# EAGLE design shield (EAGLE 6.5.0)
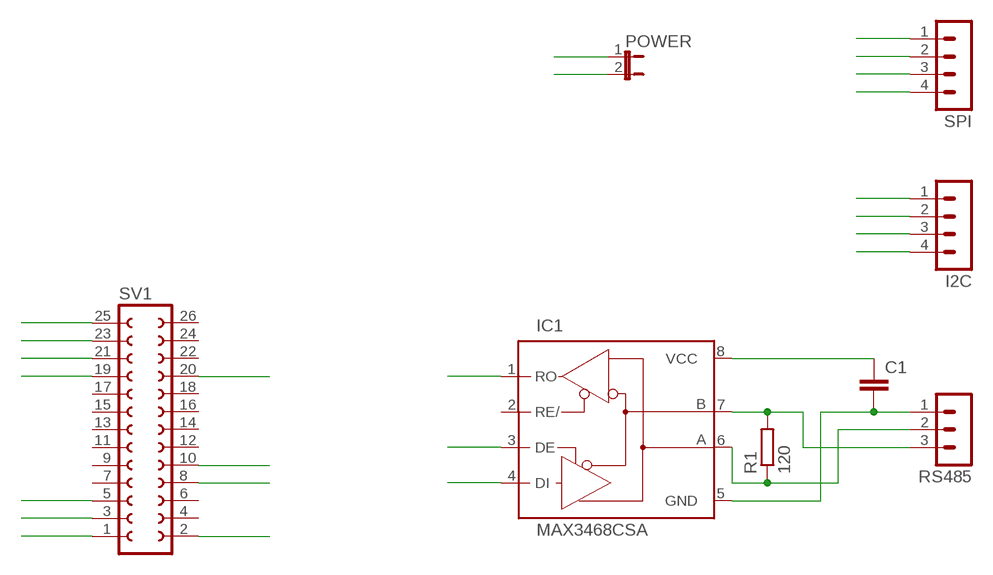
[diagram p0: schematic, sheet 1]

## Parts
C1  C-EUC0805  [C0805]
I2C  MA04-1  [MA04-1]
IC1  MAX3468CSA  [SO08]
POWER  JP1E  [JP1]
R1  120  R-EU_0207/2V  [0207/2V]
RS485  MA03-1  [MA03-1]
SPI  MA04-1  [MA04-1]
SV1  FE13-2  [FE13-2]

## Nets
3V3: C1.1 IC1.3(DE) IC1.8(VCC) SV1.1
5V0: I2C.4 POWER.2 SV1.2
GND: C1.2 I2C.1 IC1.5(GND) POWER.1 RS485.1 SPI.1 SV1.20 SV1.25
MISO: SPI.3 SV1.21
MOSI: SPI.2 SV1.19
N$1: IC1.6(A) R1.1 RS485.2
N$3: IC1.7(B) R1.2 RS485.3
RX: IC1.1(RO) SV1.10
SCL: I2C.2 SV1.5
SCLK: SPI.4 SV1.23
SDA: I2C.3 SV1.3
TX: IC1.4(DI) SV1.8
Unconnected: IC1.2(RE/) SV1.4 SV1.6 SV1.7 SV1.9 SV1.11 SV1.12 SV1.13 SV1.14 SV1.15 SV1.16 SV1.17 SV1.18 SV1.22 SV1.24 SV1.26

## Library data of the parts
C1 = rcl:C-EU: CAPACITOR, European symbol
I2C SPI = con-lstb:MA04-1: PIN HEADER; OC_FARNELL: unknown; OC_NEWARK: unknown
IC1 = maxim:MAX34*: +5V, Fail-Safe, 40Mbps, Profibus RS-485/RS-422 Transceivers Source: MAX3465-MAX3469.pdf; MPN: MAX3468CSA+; OC_FARNELL: unknown; OC_NEWARK: 76K6721
POWER = jumper:JP1E: JUMPER
R1 = rcl:R-EU_: RESISTOR, European symbol
RS485 = con-lstb:MA03-1: PIN HEADER; OC_FARNELL: unknown; OC_NEWARK: unknown
SV1 = con-lsta:FE13-2: FEMALE HEADER; OC_FARNELL: unknown; OC_NEWARK: unknown

## Board
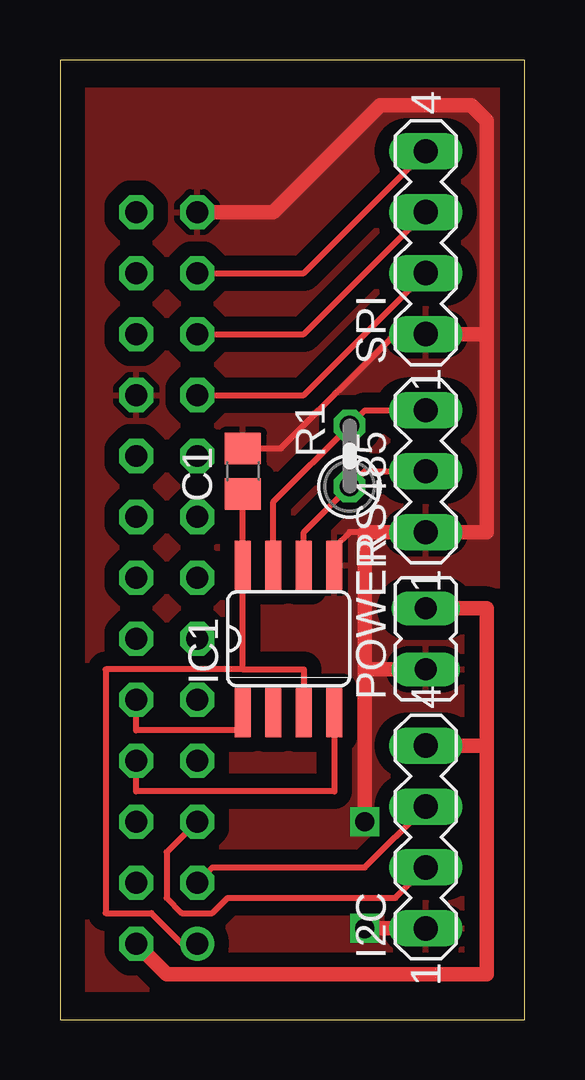
[diagram p1: board, top side]
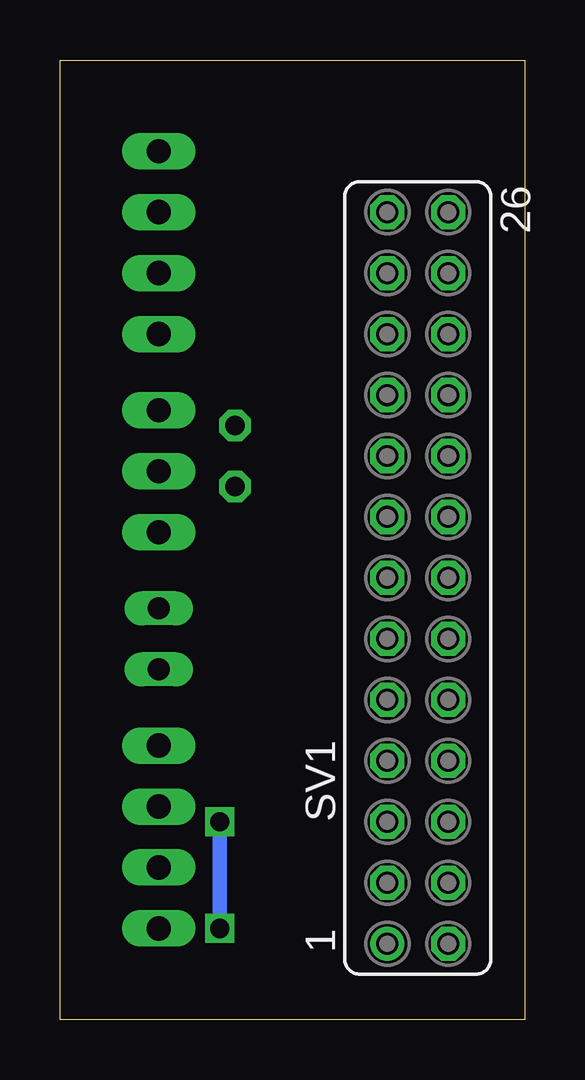
[diagram p2: board, bottom side, seen from below]

Size 19.36 x 39.99 mm. Coordinates in mm from the lower left corner, seen from the top.
Outline: 0,0 19.36,0 19.36,39.99 0,39.99 0,0
Copper layers (1*16): Top 0.035mm / dielectric 1.5mm / Bottom 0.035mm
Design rules "default *": minimum track width 10mil, minimum drill 24mil, track to track 10mil, track to pad 10mil, pad to pad 10mil, via to via 10mil, smd to smd 8mil, copper to edge 40mil, drill to drill 8mil, minimum pad ring 10mil, minimum via ring 8mil, stop-mask expansion 4mil, vias tented up to drill 0mil, thermal gap 10mil

### Footprints (pad centres in the part's own frame; a part is rotated, then mirrored left to right if it is on the bottom)
C0805 = smd 1.3 x 1.5: 1 -0.95,0; 2 0.95,0
MA04-1 = drill 1.016 long: 1 -3.81,0; 2 -1.27,0; 3 1.27,0; 4 3.81,0
SO08 = smd 0.66 x 2.032: 1 -1.905,-3.073; 2 -0.635,-3.073; 3 0.635,-3.073; 4 1.905,-3.073; 5 1.905,3.073; 6 0.635,3.073; 7 -0.635,3.073; 8 -1.905,3.073
JP1 = drill 0.914 long: 1 0,-1.27; 2 0,1.27
0207/2V = drill 0.813 octagon: 1 -1.27,0; 2 1.27,0
MA03-1 = drill 1.016 long: 1 -2.54,0; 2 0,0; 3 2.54,0
FE13-2 = drill 0.914: 1 -15.24,1.27 | drill 0.914 octagon: 2 -15.24,-1.27; 3 -12.7,1.27; 4 -12.7,-1.27; 5 -10.16,1.27; 6 -10.16,-1.27; 7 -7.62,1.27; 8 -7.62,-1.27; 9 -5.08,1.27; 10 -5.08,-1.27; 11 -2.54,1.27; 12 -2.54,-1.27; 13 0,1.27; 14 0,-1.27; 15 2.54,1.27; 16 2.54,-1.27; 17 5.08,1.27; 18 5.08,-1.27; 19 7.62,1.27; 20 7.62,-1.27; 21 10.16,1.27; 22 10.16,-1.27; 23 12.7,1.27; 24 12.7,-1.27; 25 15.24,1.27; 26 15.24,-1.27

### Placement (x,y rotation side)
C1  7.62,22.86 90 top
I2C  15.24,7.62 90 top
IC1  9.53,15.88 0 top
POWER  15.24,15.88 0 top
R1  12.06,23.5 90 top
RS485  15.24,22.86 90 top
SPI  15.24,32.38 90 top
SV1  4.45,18.41 90 bottom

### Tracks (layer width: path | path; a pad name or v marks a point on that pad's centre or on a via)
3V3
  Top 0.254: 7.62,14.61 IC1.8 C1.1 | 7.62,14.61 1.91,14.61 1.91,4.45 3.81,4.45 5.08,3.17 SV1.1 | 7.62,14.61 10.16,14.61 IC1.3
5V0
  Top 0.61: SV1.2 4.45,1.91 17.78,1.91 17.78,11.43 | I2C.4 17.78,11.43 | 17.78,11.43 17.78,17.14 POWER.2
GND  (via drill 0.8)
  Top 0.254: IC1.5 11.43,19.68 12.06,20.32 12.7,20.32 | C1.2 9.21,23.81 13.97,28.57 SPI.1
  Top 0.61: SPI.1 17.78,28.57 | 17.78,28.57 17.78,20.32 RS485.1 12.7,20.32 12.7,14.61 | SV1.25 8.89,33.66 13.34,38.1 17.14,38.1 17.78,37.47 17.78,28.57 | POWER.1 12.7,14.61 | 12.7,14.61 v12.7,8.26 | v12.7,3.81 I2C.1
  Bottom 0.61: v12.7,8.26 v12.7,3.81
  pour Top (isolate 0.61): 0.64,38.73 18.41,38.73 18.41,1.27 0.64,1.27
MISO
  Top 0.254: SV1.21 10.16,28.57 SPI.3
MOSI
  Top 0.254: SV1.19 10.16,26.04 SPI.2
N$1
  Top 0.254: IC1.6 10.16,20.32 R1.1 12.7,22.86 RS485.2
N$3
  Top 0.254: IC1.7 8.89,21.59 R1.2 12.7,25.4 RS485.3
RX
  Top 0.254: IC1.1 7.62,12.06 3.17,12.06 SV1.10
SCL
  Top 0.254: SV1.5 4.45,6.99 4.45,5.08 5.08,4.45 6.35,4.45 6.99,5.08 13.97,5.08 I2C.2
SCLK
  Top 0.254: SV1.23 10.16,31.11 SPI.4
SDA
  Top 0.254: SV1.3 6.35,6.35 12.7,6.35 I2C.3
TX
  Top 0.254: IC1.4 11.43,9.53 3.17,9.53 SV1.8